# EAGLE design BoneConductionAmp (EAGLE 6.0)
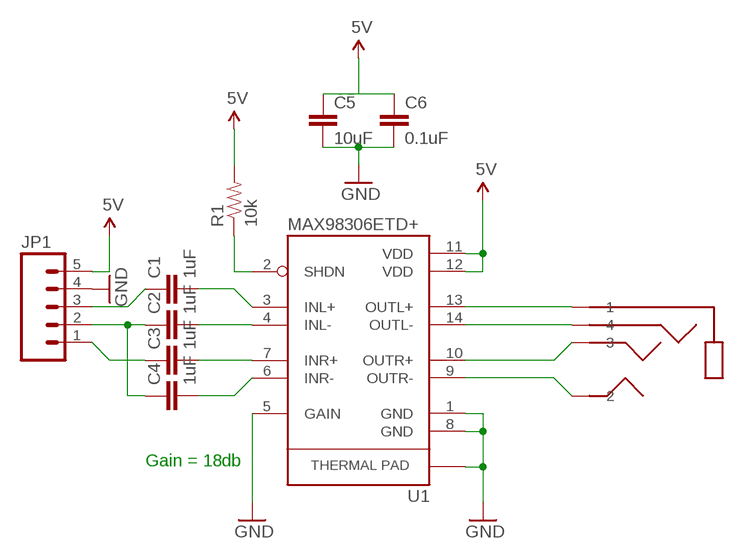
[diagram p0: schematic, sheet 1]

## Parts
C1  1uF  CAP0402-CAP  [0402-CAP]
C2  1uF  CAP0402-CAP  [0402-CAP]
C3  1uF  CAP0402-CAP  [0402-CAP]
C4  1uF  CAP0402-CAP  [0402-CAP]
C5  10uF  CAP0805  [0805]
C6  0.1uF  CAP0402-CAP  [0402-CAP]
JP1  M05PTH  [1X05]
R1  10k  RESISTOR0603-RES  [0603-RES]
U1  MAX98306ETD+  [14-TDFN]
U$4  TRRS-2.5MM-FEMALE4-CON  [TRRS-2.5MM-JACK-SMD]

## Nets
5V: C5.1 C6.1 JP1.5 R1.2 U1.11(VDD) U1.12(VDD)
GND: C5.2 C6.2 JP1.4 U1.1(GND) U1.5(GAIN) U1.8(GND) U1.15(GND)
N$1: C1.2 U1.3(INL+)
N$2: C2.2 U1.4(INL-)
N$3: C3.2 U1.7(INR+)
N$4: C4.2 U1.6(INR-)
N$5: U1.9(OUTR-) U$4.P2
N$6: U1.10(OUTR+) U$4.P3
N$7: R1.1 U1.2(SHDN)
N$8: C1.1 JP1.3
N$9: C2.1 C4.1 JP1.2
N$10: C3.1 JP1.1
N$11: U1.14(OUTL-) U$4.P4 U$4.P4.1
N$12: U1.13(OUTL+) U$4.P1

## Notes on the sheet
- Gain = 18db

## Library data of the parts
C1-C6 = SparkFun-Passives:CAP: Capacitor Standard 0603 ceramic capacitor, and 0.1" leaded capacitor.
JP1 = SparkFun-Connectors:M05: Header 5 Standard 5-pin 0.1" header. Use with straight break away headers (SKU : PRT-00116), right angle break away headers (PRT-00553), swiss pins (PRT-00743), machine pins (PRT-00117), and female headers (PRT-00115). Molex polarized connector foot print use with SKU : PRT-08230 with associated crimp pins and housings.
R1 = SparkFun-Passives:RESISTOR: Resistor Basic schematic elements and footprints for 0603, 1206, and PTH resistors.
U1 = SparkFun-PowerIC:MAX98306: Stereo 3.7W Class D Amplifier Datasheet: http://datasheets.maxim-ic.com/en/ds/MAX98306.pdf The MAX98306 stereo 3.7W Class D amplifier provides Class AB audio performance with Class D efficiency. This device offers five selectable gain settings (6dB, 9dB, 12dB, 15dB, and 18dB) set by a single gain-select input (GAIN). Active emissions limiting, edge-rate, and overshoot control circuitry combined with a filterless spread-spectrum modulation scheme (SSM) provide excellent EMI performance while eliminating the need for output filtering found in traditional Class D devices. These features reduce application component count. The IC's 2.0mA quiescent current with a 3.7V supply extends battery life in portable applications. The IC is available in a 14-pin TDFN (3mm x 3mm x 0.75mm) package specified over the extended -40NC to +85NC temperature range.
U$4 = my-custom-parts:TRRS-2.5MM-FEMALE

## Board
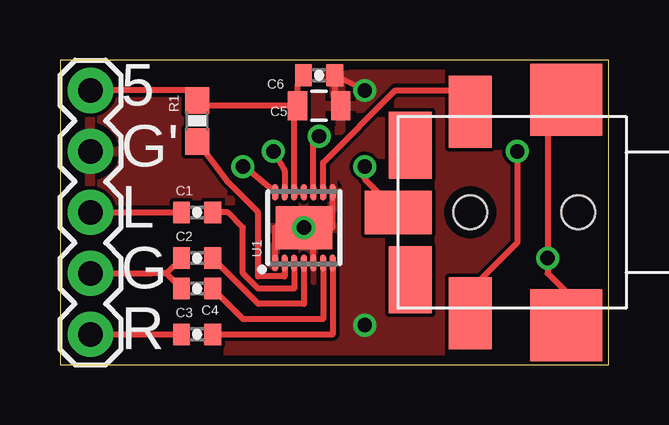
[diagram p1: board, top side]
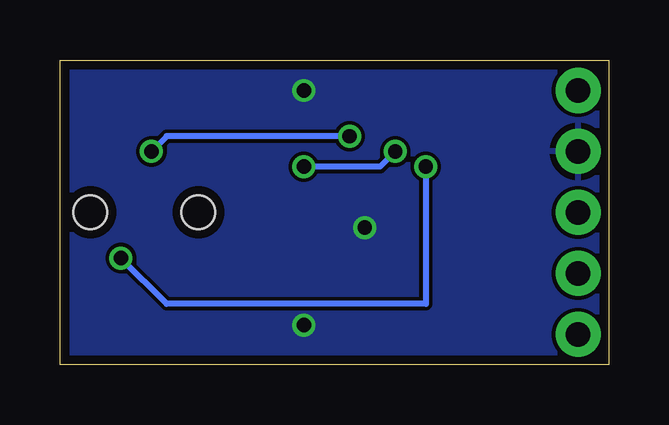
[diagram p2: board, bottom side, seen from below]

Size 22.86 x 12.7 mm. Coordinates in mm from the lower left corner, seen from the top.
Outline: 0,0 22.86,0 22.86,12.7 0,12.7 0,0
Copper layers (1*16): Top 0.0356mm / dielectric 1.5011mm / Bottom 0.0356mm
Design rules: minimum track width 6mil, minimum drill 13mil, track to track 6mil, track to pad 6mil, pad to pad 6mil, via to via 6mil, smd to smd 6mil, copper to edge 15mil, drill to drill 6mil, minimum pad ring 7mil, minimum via ring 7mil, stop-mask expansion 3mil, vias tented up to drill 0mil, thermal gap 10mil

### Footprints (pad centres in the part's own frame; a part is rotated, then mirrored left to right if it is on the bottom)
0402-CAP = smd 0.7 x 0.9: 1 -0.65,0; 2 0.65,0
0805 = smd 0.8 x 1.2: 1 -0.9,0; 2 0.9,0
1X05 = drill 1.016 pad 1.88: 1 0,0; 2 2.54,0; 3 5.08,0; 4 7.62,0; 5 10.16,0
0603-RES = smd 1.1 x 1: 1 -0.85,0; 2 0.85,0
14-TDFN = smd 0.7 x 0.25: 1 -1.475,1.2; 2 -1.475,0.8; 3 -1.475,0.4; 4 -1.475,0; 5 -1.475,-0.4; 6 -1.475,-0.8; 7 -1.475,-1.2; 8 1.475,-1.2; 9 1.475,-0.8; 10 1.475,-0.4; 11 1.475,0; 12 1.475,0.4; 13 1.475,0.8; 14 1.475,1.2 | smd 1.78 x 2.35: 15 0,0
TRRS-2.5MM-JACK-SMD = smd 2.8 x 1.8: P1 7.5,0 | smd 1.8 x 3: P2 4.5,-4.2; P3 4.5,4.2 | smd 3 x 3: P4 0.5,4.7; P4.1 0.5,-4.7 | smd 1.8 x 2.8: P5 7,-2.8; P6 7,2.8 | hole 1.4: 4.5,0; 0,0

### Placement (x,y rotation side)
C1  5.71,6.35 0 top
C2  5.71,4.45 0 top
C3  5.71,1.27 0 top
C4  5.71,3.17 0 top
C5  10.79,10.79 0 top
C6  10.79,12.06 0 top
JP1  1.27,1.27 90 top
R1  5.71,10.16 90 top
U1  10.16,5.71 90 top
U$4  21.59,6.35 180 top

### Tracks (layer width: path | path; a pad name or v marks a point on that pad's centre or on a via)
5V
  Top 0.254: C5.1 9.91,11.7 C6.1 10.16,12.05 | JP1.5 5.29,11.43 R1.2 5.93,10.79 C5.1 | U1.11 U1.12 9.76,10.66 C5.1
GND  (via drill 0.6)
  Top 0.254: U1.5 10.56,5.32 U1.15 | U1.15 11.36,5.71 U1.8 | U1.1 8.96,5.71 U1.15 | v12.7,11.43 C6.2 11.45,11.04 C5.2
  other vias: 12.7,1.65 10.16,5.71
  pour Top: 0,12.7 22.86,12.7 22.86,0 0,0
  pour Bottom: 0,12.7 22.86,12.7 22.86,0 0,0
N$1
  Top 0.254: U1.3 9.76,3.17 8.26,3.17 7.62,3.81 7.62,5.71 6.99,6.35 C1.2 6.35,6.35
N$2
  Top 0.254: U1.4 10.16,2.54 8.27,2.54 C2.2
N$3
  Top 0.254: C3.2 11.36,1.27 U1.7
N$4
  Top 0.254: U1.6 10.96,1.91 7.63,1.91 C4.2
N$5
  Top 0.254: U1.9 10.96,8.42 13.97,11.43 16.21,11.43 U$4.P2
N$6  (via drill 0.6)
  Top 0.254: U1.10 10.56,9.29 v10.79,9.53 | v19.05,8.89 19.05,5.08 17.09,3.12 U$4.P3
  Bottom 0.254: v10.79,9.53 18.41,9.53 v19.05,8.89
N$7
  Top 0.254: U1.2 9.36,3.68 8.26,3.68 8.26,6.35 6.99,7.62 R1.1
N$8
  Top 0.254: JP1.3 C1.1
N$9
  Top 0.254: JP1.2 3.81,3.81 4.43,3.81 | C2.1 4.43,3.81 | C4.1 4.43,3.81
N$10
  Top 0.254: JP1.1 C3.1
N$11  (via drill 0.6)
  Top 0.254: U1.14 7.69,8.26 v7.62,8.26 | U$4.P4 21.09,3.04 20.32,3.81 v20.32,4.45 20.32,10.28 U$4.P4.1
  Bottom 0.254: v7.62,8.26 7.62,2.54 18.41,2.54 v20.32,4.45
N$12  (via drill 0.6)
  Top 0.254: U$4.P1 12.7,7.74 v12.7,8.26 | v8.89,8.89 9.36,8.09 U1.13
  Bottom 0.254: v8.89,8.89 9.53,8.26 v12.7,8.26

### Text on the board
tNames: 5 | G' | L | G | R